# EAGLE design Adafruit MatrixPortal M4 (EAGLE 9.6.2)
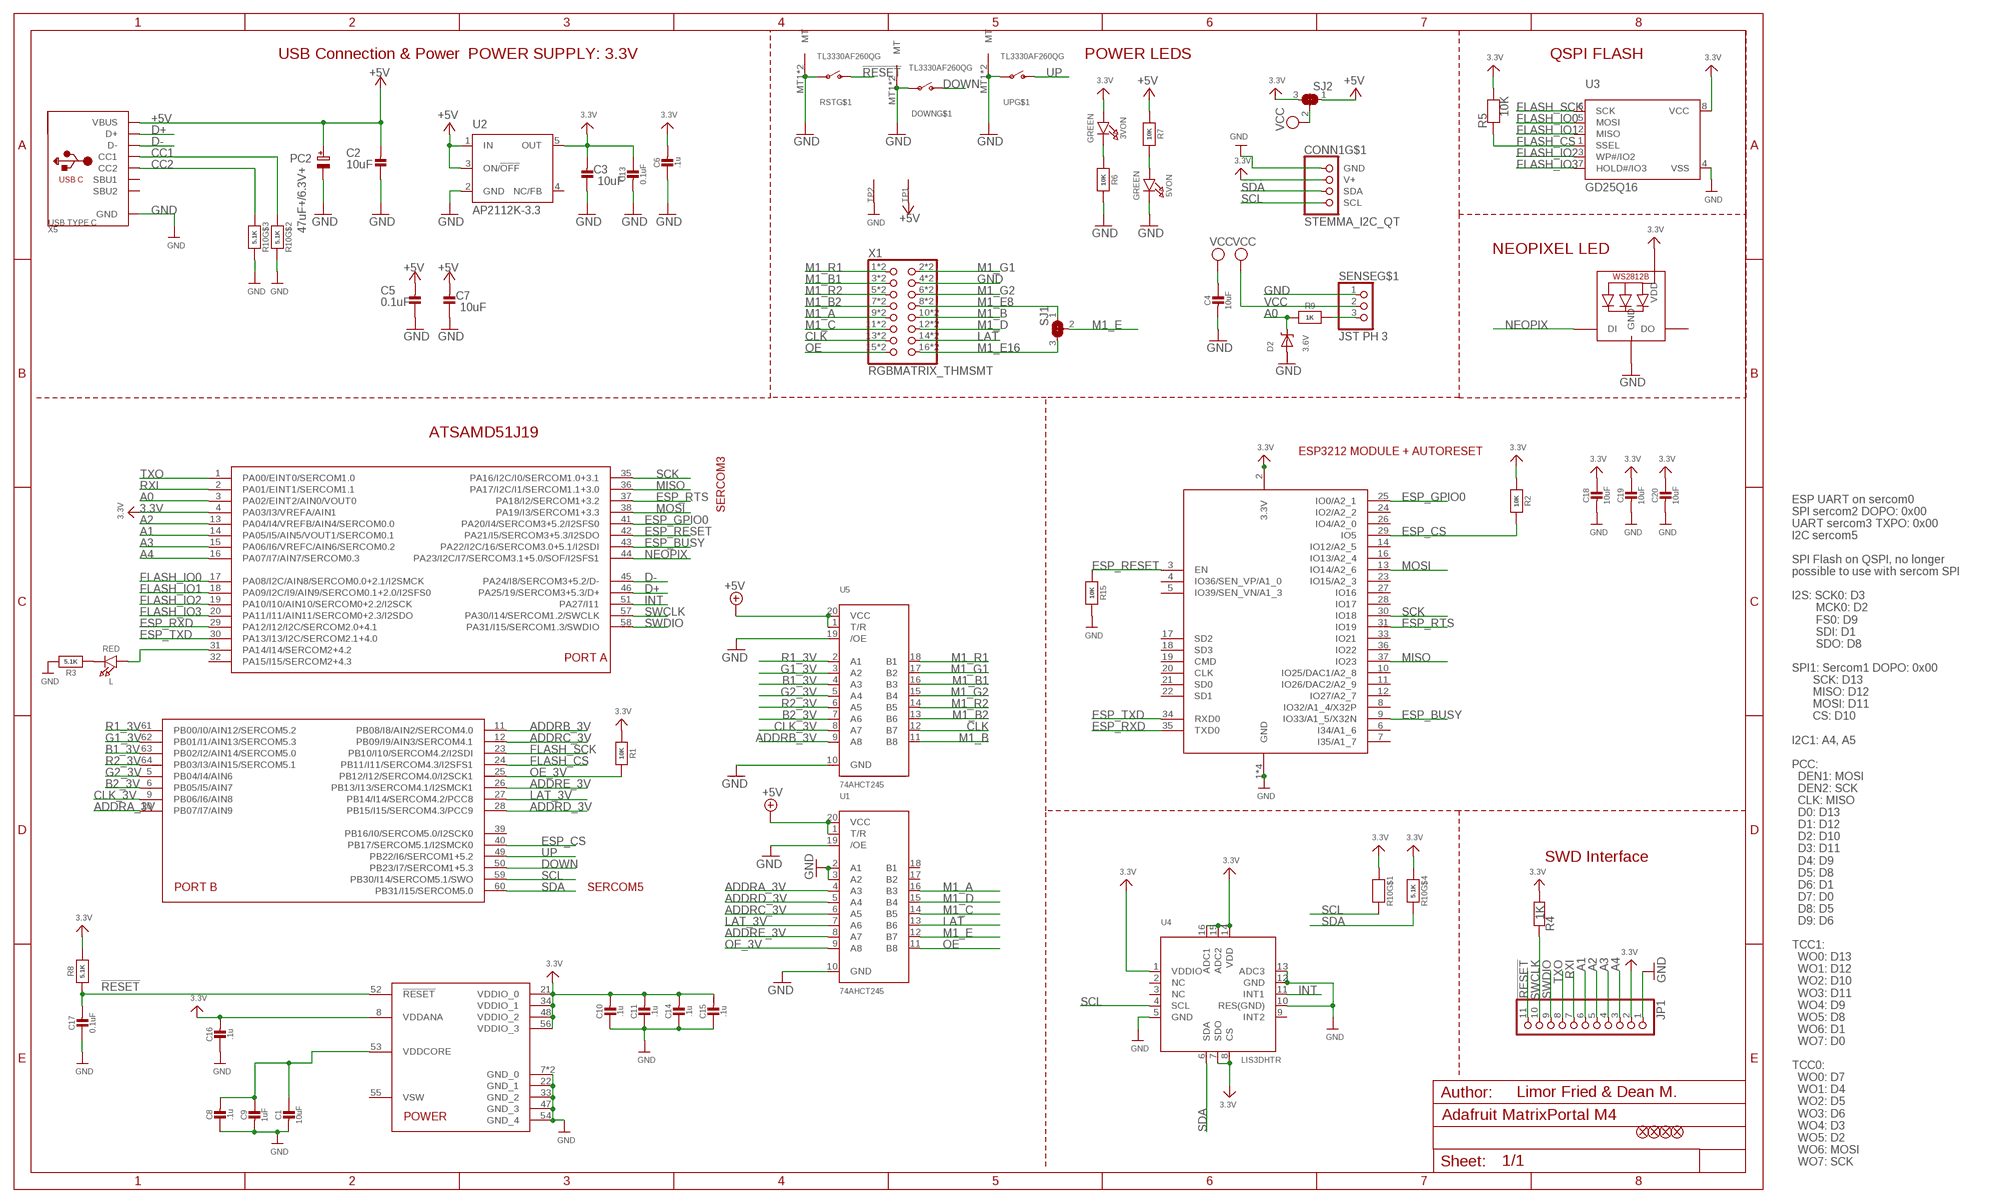
[diagram p0: schematic, sheet 1]

## Parts
3VON  GREEN  LED0805_NOOUTLINE  [CHIPLED_0805_NOOUTLINE]
5VON  GREEN  LED0805_NOOUTLINE  [CHIPLED_0805_NOOUTLINE]
C1  10uF  CAP_CERAMIC0805-NOOUTLINE  [0805-NO]
C2  10uF  CAP_CERAMIC0805-NOOUTLINE  [0805-NO]
C3  10uF  CAP_CERAMIC0805-NOOUTLINE  [0805-NO]
C4  10uF  CAP_CERAMIC0805-NOOUTLINE  [0805-NO]
C5  0.1uF  CAP_CERAMIC0603_NO  [0603-NO]
C6  .1u  CAP_CERAMIC0603_NO  [0603-NO]
C7  10uF  CAP_CERAMIC0805-NOOUTLINE  [0805-NO]
C8  .1u  CAP_CERAMIC0603_NO  [0603-NO]
C9  1uF  CAP_CERAMIC0603_NO  [0603-NO]
C10  .1u  CAP_CERAMIC0603_NO  [0603-NO]
C11  .1u  CAP_CERAMIC0603_NO  [0603-NO]
C13  0.1uF  CAP_CERAMIC0603_NO  [0603-NO]
C14  .1u  CAP_CERAMIC0603_NO  [0603-NO]
C15  .1u  CAP_CERAMIC0603_NO  [0603-NO]
C16  .1u  CAP_CERAMIC0603_NO  [0603-NO]
C17  0.1uF  CAP_CERAMIC0603_NO  [0603-NO]
C18  10uF  CAP_CERAMIC0805-NOOUTLINE  [0805-NO]
C19  10uF  CAP_CERAMIC0805-NOOUTLINE  [0805-NO]
C20  10uF  CAP_CERAMIC0805-NOOUTLINE  [0805-NO]
CONN1  STEMMA_I2C_QT  [JST_SH4]
D2  3.6V  DIODE-ZENERSOD323  [SOD-323]
DOWN  TL3330AF260QG  SWITCH_SPST_TACT_RA  [SPST_TACTILE_RA]
FID1  FIDUCIAL_1MM  [FIDUCIAL_1MM]
FID2  FIDUCIAL_1MM  [FIDUCIAL_1MM]
FID3  FIDUCIAL_1MM  [FIDUCIAL_1MM]
FID4  FIDUCIAL_1MM  [FIDUCIAL_1MM]
JP1  HEADER-1X11  [1X11_ROUND]
L  RED  LED0603_NOOUTLINE  [CHIPLED_0603_NOOUTLINE]
LED1  WS2812B3535  [LED3535]
PC2  47uF+/6.3V+  CAP_ELECTROLYTICPANASONIC_D  [PANASONIC_D]
R1  10K  RESISTOR_0603_NOOUT  [0603-NO]
R2  10K  RESISTOR_0603_NOOUT  [0603-NO]
R3  5.1K  RESISTOR_0603_NOOUT  [0603-NO]
R4  1K  RESISTOR_0603_NOOUT  [0603-NO]
R5  10K  RESISTOR_0603_NOOUT  [0603-NO]
R6  10K  RESISTOR_0603_NOOUT  [0603-NO]
R7  10K  RESISTOR_0603_NOOUT  [0603-NO]
R8  5.1K  RESISTOR_0603_NOOUT  [0603-NO]
R9  1K  RESISTOR_0603_NOOUT  [0603-NO]
R10  5.1K  RESISTOR_4PACK  [RESPACK_4X0603]
R15  10K  RESISTOR_0603_NOOUT  [0603-NO]
RST  TL3330AF260QG  SWITCH_SPST_TACT_RA  [SPST_TACTILE_RA]
SENSE  JST PH 3  CON_JST_PH_3PIN  [JSTPH3]
SJ1  SOLDERJUMPER_2WAY  [SOLDERJUMPER_2WAY_OPEN_NOPASTE]
SJ2  SOLDERJUMPER_2WAY  [SOLDERJUMPER_2WAY_OPEN_NOPASTE]
TP1  SEWTAP_SMTNUTM3  [SMT_NUT_3MM]
TP2  SEWTAP_SMTNUTM3  [SMT_NUT_3MM]
U1  74AHCT245  74LCX245  [TSSOP20]
U2  AP2112K-3.3  LP2985-XXDBVR33  [SOT23-DBV]
U3  GD25Q16  SPIFLASH_8PIN208MIL  [SOIC8_208MIL]
U4  LIS3DHTR  ACCEL_LIS3DHTR  [LGA16_3X3MM]
U5  74AHCT245  74LCX245  [TSSOP20]
U$1  ATSAMD51J19  ATSAMD51J  [PQFN64-1]
UP  TL3330AF260QG  SWITCH_SPST_TACT_RA  [SPST_TACTILE_RA]
X1  RGBMATRIX_THMSMT  [2X08_SMTTHM_RGBMATRIX]
X5  USB TYPE C  USB_C  [USB_C_CUSB31-CFM2AX-01-X]
X6  ESP32_WROOM32  [WROOM32]

## Nets
3.3V: 3VON.A C3.2 C6.2 C10.2 C11.2 C13.1 C14.2 C15.2 C16.2 C18.1 C19.1 C20.1 CONN1.2(V+) JP1.2 LED1.2(VDD) R1.1 R2.1 R4.2 R5.2 R8.2 R10.1 R10.4 SJ2.3 U2.5(OUT) U3.8(VCC) U4.1(VDDIO) U4.7(SDO) U4.8(CS) U4.14(VDD) U4.15(ADC2) U4.16(ADC1) U$1.4(PA03/I3/VREFA/AIN1) U$1.8(VDDANA) U$1.21(VDDIO_0) U$1.34(VDDIO_1) U$1.48(VDDIO_2) U$1.56(VDDIO_3) X6.2(3.3V)
!RESET: C17.2 JP1.11 R8.1 RST.2(S) U$1.52(!RESET)
+5V [usbvcc]: C2.2 C5.2 C7.2 PC2.+ R7.1 SJ2.1 TP1.P$1(SEW) U1.1(T/R) U1.20(VCC) U2.1(IN) U2.3(ON/!OFF) U5.1(T/R) U5.20(VCC) X5.A4B9(VBUS) X5.B4A9(VBUS)
A0: D2.C R9.2 U$1.3(PA02/EINT2/AIN0/VOUT0)
A0_JST: R9.1 SENSE.3
A1: JP1.6 U$1.14(PA05/I5/AIN5/VOUT1/SERCOM0.1)
A2: JP1.5 U$1.13(PA04/I4/VREFB/AIN4/SERCOM0.0)
A3: JP1.4 U$1.15(PA06/I6/VREFC/AIN6/SERCOM0.2)
A4: JP1.3 U$1.16(PA07/I7/AIN7/SERCOM0.3)
ADDRA_3V: U1.4(A3) U$1.10(PB07/I7/AIN9)
ADDRB_3V: U5.9(A8) U$1.11(PB08/I8/AIN2/SERCOM4.0)
ADDRC_3V: U1.6(A5) U$1.12(PB09/I9/AIN3/SERCOM4.1)
ADDRD_3V: U1.5(A4) U$1.28(PB15/I15/SERCOM4.3/PCC9)
ADDRE_3V: U1.8(A7) U$1.26(PB13/I13/SERCOM4.1/I2SMCK1)
B1_3V: U5.4(A3) U$1.63(PB02/I2/AIN14/SERCOM5.0)
B2_3V: U5.7(A6) U$1.6(PB05/I5/AIN7)
CC1: R10.2 X5.A5(CC1)
CC2: R10.3 X5.B5(CC2)
CLK: U5.12(B7) X1.13 X1.13S
CLK_3V: U5.8(A7) U$1.9(PB06/I6/AIN8)
D+: U$1.46(PA25/19/SERCOM3+5.3/D+) X5.A6(D+) X5.B6(D+)
D-: U$1.45(PA24/I8/SERCOM3+5.2/D-) X5.A7(D-) X5.B7(D-)
DOWN: DOWN.2(S) U$1.50(PB23/I7/SERCOM1+5.3)
ESP_BUSY: U$1.43(PA22/I2C/16/SERCOM3.0+5.1/I2SDI) X6.9(IO33/A1_5/X32N)
ESP_CS: R2.2 U$1.40(PB17/SERCOM5.1/I2SMCK0) X6.29(IO5)
ESP_GPIO0: U$1.41(PA20/I4/SERCOM3+5.2/I2SFS0) X6.25(IO0/A2_1)
ESP_RESET: R15.1 U$1.42(PA21/I5/SERCOM3+5.3/I2SDO) X6.3(EN)
ESP_RTS: U$1.37(PA18/I2/SERCOM1+3.2) X6.31(IO19)
ESP_RXD: U$1.29(PA12/I12/I2C/SERCOM2.0+4.1) X6.35(TXD0)
ESP_TXD: U$1.30(PA13/I13/I2C/SERCOM2.1+4.0) X6.34(RXD0)
FLASH_CS: R5.1 U3.1(SSEL) U$1.24(PB11/I11/SERCOM4.3/I2SFS1)
FLASH_IO0: U3.5(MOSI) U$1.17(PA08/I2C/AIN8/SERCOM0.0+2.1/I2SMCK)
FLASH_IO1: U3.2(MISO) U$1.18(PA09/I2C/I9/AIN9/SERCOM0.1+2.0/I2SFS0)
FLASH_IO2: U3.3(WP#/IO2) U$1.19(PA10/I10/AIN10/SERCOM0+2.2/I2SCK)
FLASH_IO3: U3.7(HOLD#/IO3) U$1.20(PA11/I11/AIN11/SERCOM0+2.3/I2SDO)
FLASH_SCK: U3.6(SCK) U$1.23(PB10/I10/SERCOM4.2/I2SDI)
G1_3V: U5.3(A2) U$1.62(PB01/I1/AIN13/SERCOM5.3)
G2_3V: U5.5(A4) U$1.5(PB04/I4/AIN6)
GND [lowpower]: 5VON.C C1.2 C2.1 C3.1 C4.2 C5.1 C6.1 C7.1 C8.1 C9.2 C10.1 C11.1 C13.2 C14.1 C15.1 C16.1 C17.1 C18.2 C19.2 C20.2 CONN1.1(GND) D2.A DOWN.1(P) DOWN.MT1(MT) DOWN.MT2(MT) JP1.1 LED1.4(GND) PC2.- R3.2 R6.2 R10.6 R10.7 R15.2 RST.1(P) RST.MT1(MT) RST.MT2(MT) SENSE.1 TP2.P$1(SEW) U1.2(A1) U1.3(A2) U1.10(GND) U1.19(/OE) U2.2(GND) U3.4(VSS) U4.5(GND) U4.10(RES(GND)) U4.12(GND) U4.13(ADC3) U5.10(GND) U5.19(/OE) U$1.7(GND_0) U$1.22(GND_1) U$1.33(GND_2) U$1.47(GND_3) U$1.54(GND_4) U$1.EXP(GND_0) UP.1(P) UP.MT1(MT) UP.MT2(MT) X1.4 X1.4S X5.A1B12(GND) X5.B1A12(GND) X6.1(GND) X6.15(GND) X6.38(GND) X6.P$1(GND)
INT: U4.11(INT1) U$1.51(PA27/I11)
LAT: U1.13(B6) X1.14 X1.14S
LAT_3V: U1.7(A6) U$1.27(PB14/I14/SERCOM4.2/PCC8)
M1_A: U1.16(B3) X1.9 X1.9S
M1_B: U5.11(B8) X1.10 X1.10S
M1_B1: U5.16(B3) X1.3 X1.3S
M1_B2: U5.13(B6) X1.7 X1.7S
M1_C: U1.14(B5) X1.11 X1.11S
M1_D: U1.15(B4) X1.12 X1.12S
M1_E: SJ1.2 U1.12(B7)
M1_E8: SJ1.1 X1.8 X1.8S
M1_E16: SJ1.3 X1.16 X1.16S
M1_G1: U5.17(B2) X1.2 X1.2S
M1_G2: U5.15(B4) X1.6 X1.6S
M1_R1: U5.18(B1) X1.1 X1.1S
M1_R2: U5.14(B5) X1.5 X1.5S
MISO: U$1.36(PA17/I2C/I1/SERCOM1.1+3.0) X6.37(IO23)
MOSI: U$1.38(PA19/I3/SERCOM1+3.3) X6.13(IO14/A2_6)
N$1: 5VON.A R7.2
N$2: 3VON.C R6.1
N$4: L.A U$1.31(PA14/I14/SERCOM2+4.2)
N$5: L.C R3.1
NEOPIX: LED1.1(DI) U$1.44(PA23/I2C/I7/SERCOM3.1+5.0/SOF/I2SFS1)
OE: U1.11(B8) X1.15 X1.15S
OE_3V: R1.2 U1.9(A8) U$1.25(PB12/I12/SERCOM4.0/I2SCK1)
R1_3V: U5.2(A1) U$1.61(PB00/I0/AIN12/SERCOM5.2)
R2_3V: U5.6(A5) U$1.64(PB03/I3/AIN15/SERCOM5.1)
RXI: JP1.7 U$1.2(PA01/EINT1/SERCOM1.1)
SCK: U$1.35(PA16/I2C/I0/SERCOM1.0+3.1) X6.30(IO18)
SCL: CONN1.4(SCL) R10.8 U4.4(SCL) U$1.59(PB30/I14/SERCOM5.1/SWO)
SDA: CONN1.3(SDA) R10.5 U4.6(SDA) U$1.60(PB31/I15/SERCOM5.0)
SWCLK: JP1.10 R4.1 U$1.57(PA30/I14/SERCOM1.2/SWCLK)
SWDIO: JP1.9 U$1.58(PA31/I15/SERCOM1.3/SWDIO)
TXO: JP1.8 U$1.1(PA00/EINT0/SERCOM1.0)
UP: U$1.49(PB22/I6/SERCOM1+5.2) UP.2(S)
VCC [power]: C4.1 SENSE.2 SJ2.2
VDDCORE: C1.1 C8.2 C9.1 U$1.53(VDDCORE)
Unconnected: CONN1.MT1(MT) CONN1.MT2(MT) LED1.3(DO) SENSE.NC1(MT) SENSE.NC2(MT) U1.17(B2) U1.18(B1) U2.4(NC/FB) U4.2(NC) U4.3(NC) U4.9(INT2) U$1.32(PA15/I15/SERCOM2+4.3) U$1.39(PB16/I0/SERCOM5.0/I2SCK0) U$1.55(VSW) X5.A8(SBU1) X5.B8(SBU2) X6.4(IO36/SEN_VP/A1_0) X6.5(IO39/SEN_VN/A1_3) X6.6(I34/A1_6) X6.7(I35/A1_7) X6.8(IO32/A1_4/X32P) X6.10(IO25/DAC1/A2_8) X6.11(IO26/DAC2/A2_9) X6.12(IO27/A2_7) X6.14(IO12/A2_5) X6.16(IO13/A2_4) X6.17(SD2) X6.18(SD3) X6.19(CMD) X6.20(CLK) X6.21(SD0) X6.22(SD1) X6.23(IO15/A2_3) X6.24(IO2/A2_2) X6.26(IO4/A2_0) X6.27(IO16) X6.28(IO17) X6.33(IO21) X6.36(IO22)

## Notes on the sheet
- USB Connection & Power | POWER SUPPLY: 3.3V | POWER LEDS | QSPI FLASH
- NEOPIXEL LED
- ATSAMD51J19
- ESP3212 MODULE + AUTORESET
- SERCOM3
- SWD Interface
- SERCOM5
- Limor Fried & Dean M.
- ESP UART on sercom0
  SPI sercom2 DOPO: 0x00
  UART sercom3 TXPO: 0x00
  I2C sercom5
  
  SPI Flash on QSPI, no longer
  possible to use with sercom SPI
  
  I2S: SCK0: D3
          MCK0: D2
          FS0: D9
          SDI: D1
          SDO: D8
  
  SPI1: Sercom1 DOPO: 0x00
         SCK: D13
         MISO: D12
         MOSI: D11
         CS: D10
  
  I2C1: A4, A5
  
  PCC:
    DEN1: MOSI
    DEN2: SCK
    CLK: MISO
    D0: D13
    D1: D12
    D2: D10
    D3: D11
    D4: D9
    D5: D8
    D6: D1
    D7: D0
    D8: D5
    D9: D6
  
  TCC1:
    WO0: D13
    WO1: D12
    WO2: D10
    WO3: D11
    WO4: D9
    WO5: D8
    WO6: D1
    WO7: D0
  
  TCC0:
    WO0: D7
    WO1: D4
    WO2: D5
    WO3: D6
    WO4: D3
    WO5: D2
    WO6: MOSI
    WO7: SCK

## Library data of the parts
3VON 5VON L = microbuilder:LED: LED 0603 - 0603 Surface Mount Package 2mA: Green LED - Low Power (3.9mcd, 2ma, 1.7Vf) - Digikey: 475-2709-2-ND Orange LED - Low Power (9.8mcd, 2ma, 1.8Vf) - Digikey: 475-1194-2-ND Red LED - Low Power (5mcd, 2ma, 1.8Vf) - Digikey: 475-1195-2-ND Yellow LED - Low Power (7mcd, 2ma, 1.8Vf) - Digikey: 475-1196-2-ND 5mA: Blue LED - Low Power (17mcd, 5ma, 2.9Vf) - Digikey: LNJ937W8CRACT-ND 0805 - 0805 Surface Mount Package 2mA: Red LED (8.8mcd, 2mA, 1.8Vf, Clear) - Low Power [Digikey: 475-2510-1-ND] Green LED (5mcd, 2mA, 1.8Vf, Clear) - Low Power [Digikey: 475-2730-1-ND] Yellow LED (11.3mcd, 2mA, 1.8Vf, Clear) - Low Power [Digikey: 475-2555-1-ND] 20mA: Red LED (104mcd, 20mA, Diffused) - LS R976 [Digikey: 475-1278-6-ND] Red LED (12mcd, 20mA, 2.0Vf, Clear) - APT2012EC [Digikey: 754-1128-1-ND] Green LED (15mcd, 20mA, 2.2Vf, Clear) - APT2012GC [Digikey: 754-1131-1-ND] Orange LED (160mcd, 20mA, 2.1Vf, Clear) - APT2012SECK [Digikey: 754-1130-1-ND] 1206 - 1206 Surface Mount Package Green LED (26mcd, 20mA, Diffused) - LG N971 [Digikey: 475-1407-6-ND] Red LED (15mcd, 20mA, Diffused) - LH N974 [Digikey: 475-1416-6-ND] Cree - Cree High-Power Surface Mount LEDs XPEBWT-L1-0000-00D50 - White 111lm 350mA 2.9Vf 6200K 110° XTEAWT-00-0000-00000LEE3 - White 114lm 350mA 2.85Vf 5000K 115° Everlight - Everlight 45-21 Series Surface Mount LEDs 45-21/QK2C-B2832AC2CB2/2T - Warm White 2000mcd 20mA 3.25Vf 3050K 120° 45-21/LK2C-B38452C4CB2/2T - Nuetral White 2000mcd 20mA 3.25Vf 4150K 120° 45-21/LK2C-B50634C6CB2/2T - Cold White 2200mcd 20mA 3.25Vf 5650K 120° PLCC2 Reverse Mount LS T77K-J1L2-1-0-2-R18-Z - Red 11.25mcd 2mA 1.8Vf 630nm 120° LO T77K-L1M2-24-Z - Orange 19.6mcd 2mA 1.8Vf 606nm 120° LY T77K-K2M1-26-Z - Yellow 15.7mcd 2mA 1.8Vf 587nm 120°
C1-C11 C13-C20 = microbuilder:CAP_CERAMIC: Ceramic Capacitors For new designs, use the packages preceded by an '_' character since they are more reliable: The following footprints should be used on most boards: _0402 - Standard footprint for regular board layouts _0603 - Standard footprint for regular board layouts _0805 - Standard footprint for regular board layouts _1206 - Standard footprint for regular board layouts For extremely tight-pitch boards where space is at a premium, the following 'micro-pitch' footprints can be used (smaller pads, no silkscreen outline, etc.): _0402MP - Micro-pitch footprint for very dense/compact boards _0603MP - Micro-pitch footprint for very dense/compact boards _0805MP - Micro-pitch footprint for very dense/compact boards _1206MP - Micro-pitch footprint for very dense/compact boards
CONN1 = microbuilder:STEMMA_I2C
D2 = microbuilder:DIODE-ZENER: Zener Diode SMA: 30V 1W Zener Diode, 1.2Vf - Digikey: SMAZ30-FDICT-ND
DOWN RST UP = microbuilder:SWITCH_SPST: Switch - SPST 4UCon 19192 (6.7x2.6mm SMT)
FID1-FID4 = microbuilder:FIDUCIAL: Fiducial Alignment Points Various fiducial points for machine vision alignment.; BOM: EXCLUDE
JP1 = microbuilder:HEADER-1X11
LED1 = microbuilder:WS2812B
PC2 = microbuilder:CAP_ELECTROLYTIC: Electrolytic Capacitors SMT PANASONIC_C - Size C Panasonic Electrolytic Aluminum Capacitor 47µF 16V 20% Electrolytic Capacitor [Digikey: PCE3890TR-ND] PANASONIC_D - Size D Panasonic Electrolytic Aluminum Capacitor 100µF 25V 20% Electrolytic Capacitor [Digikey: PCE3898TR-ND] PTH 3.5 mm grid, 8 mm diameter ... 3.5 mm grid, 10 mm diameter ...
R1-R9 R15 = microbuilder:RESISTOR: Resistors For new designs, use the packages preceded by an '_' character since they are more reliable: The following footprints should be used on most boards: _0402 - Standard footprint for regular board layouts _0603 - Standard footprint for regular board layouts _0805 - Standard footprint for regular board layouts _1206 - Standard footprint for regular board layouts For extremely tight-pitch boards where space is at a premium, the following 'micro-pitch' footprints can be used (smaller pads, no silkscreen outline, etc.): _0402MP - Micro-pitch footprint for very dense/compact boards _0603MP - Micro-pitch footprint for very dense/compact boards _0805MP - Micro-pitch footprint for very dense/compact boards _1206MP - Micro-pitch footprint for very dense/compact boards
R10 = microbuilder:RESISTOR_4PACK: Resistor Packs (4 resistors) 4 x 0603 10K 1/16W - Digikey: YC164J-10KCT-ND
SENSE = microbuilder:CON_JST_PH_3PIN
SJ1 SJ2 = microbuilder:SOLDERJUMPER_2WAY: 2-Way Solder Jumper
TP1 TP2 = microbuilder:SEWTAP
U1 U5 = microbuilder:74LCX245: 74LCX245MTC - 5.0V Tolerant Bi-Directional Buffer Can be used to interface 5.0V logic to 2.5 or 3.3V devices Digikey: 74LCX245MTCXTR-ND Mouser: 512-74LCX245MTCX
U2 = SmartPrj:LP2985-XXDBVR: ULTRALOW-POWER 50-mA LOW-DROPOUT LINEAR REGULATORS 50-mA Low-Dropout Regulator Source: http://focus.ti.com/lit/ds/symlink/tps77001.pdf
U3 = microbuilder:SPIFLASH_8PIN: SOIC8 SPI Flash Be careful with the size since SOIC8 flash comes in several 'widths' SOIC8 150 mil M25P16 - 16Mbit (2Mbit x 8) Serial Flash (75MHz SPI Bus), Supply: 2.7-3.6V Digikey: SOIC8 - M25P16-VMN6P-ND SOIC8 208 mil W25Q16BVSSIG - 16Mbit (2Mbit x 8) Serial Flash (104MHz SPI Bus), Supply: 2.7-3.6V Digikey: SOIC8 - W25Q16BVSSIG-ND
U4 = adafruit_sensor:ACCEL_LIS3DHTR: LIS3DHTR 3-Axis Accelerometer with I2C/SPI Interface VDD: 1.71-3.6V VDDIO: 1.71-VDD+0.1V Scale: +/-2g, 4g, 8g, 16g with 16--bit data output Temp:: -40°C - 85°C Mouser: 511-LIS3DHTR Digikey: 497-10613-1-ND
U$1 = adafruit_micro:ATSAMD51J: ATSAMD51J cortex m4 microcontroller
X1 = microbuilder:RGBMATRIX_THMSMT
X5 = microbuilder:USB_C: USB Type-C USB 2.0 Connector
X6 = microbuilder:ESP32_WROOM32

## Net classes
1 power: width 0.305 mm
2 lowpower: width 0.305 mm, drill 0.483 mm

## Board
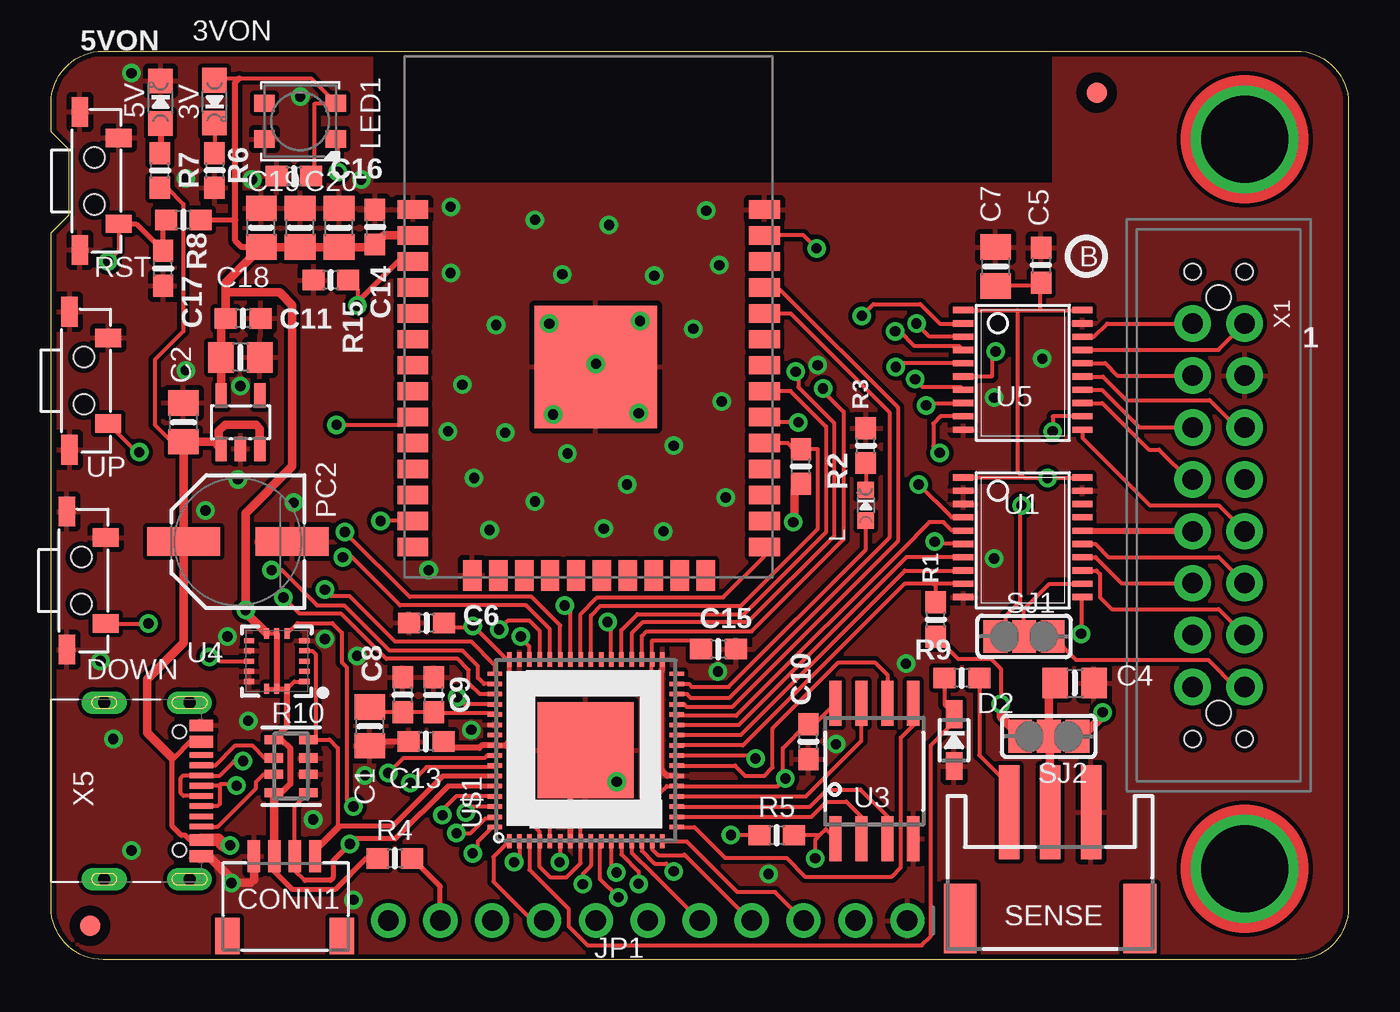
[diagram p1: board, top side]
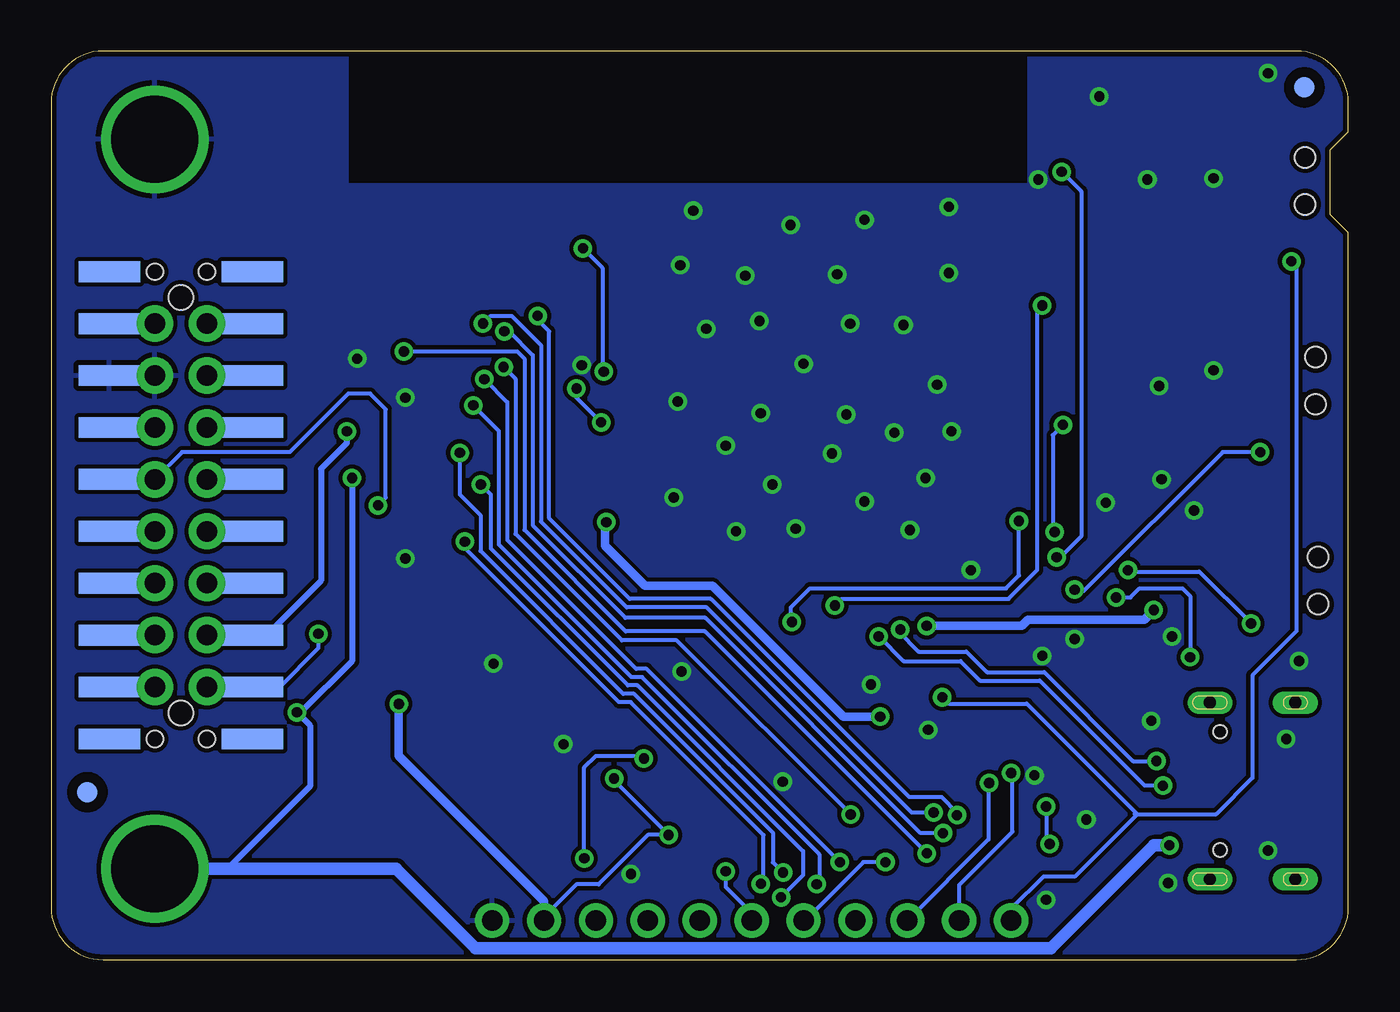
[diagram p2: board, bottom side, seen from below]

Size 63.5 x 44.45 mm. Coordinates in mm from the lower left corner, seen from the top.
Outline: 63.5,41.91 63.5,2.54 arc-90 60.96,0 2.54,0 arc-90 0,2.54 0,35.56 0.89,36.45 0.89,39.62 0,40.51 0,41.91 arc-90 2.54,44.45 60.96,44.45 arc-90 63.5,41.91
Copper layers (1*16): Top 0.035mm / dielectric 1.5mm / Bottom 0.035mm
Design rules "adafruit *": minimum track width 8mil, minimum drill 15.5mil, track to track 8mil, track to pad 8mil, pad to pad 8mil, via to via 8mil, smd to smd 8mil, copper to edge 10mil, drill to drill 8mil, minimum pad ring 10mil, minimum via ring 8mil, stop-mask expansion 2mil, vias tented up to drill 20mil, thermal gap 10mil

### Footprints (pad centres in the part's own frame; a part is rotated, then mirrored left to right if it is on the bottom)
CHIPLED_0805_NOOUTLINE = smd 1.2 x 1.2: A 0,-1.05; C 0,1.05
0805-NO = smd 1.24 x 1.5: 1 -0.95,0; 2 0.95,0
0603-NO = smd 1.075 x 1: 1 -0.85,0; 2 0.85,0
JST_SH4 = smd 0.6 x 1.55: 1 -1.5,2.514; 2 -0.5,2.514; 3 0.5,2.514; 4 1.5,2.514 | smd 1.2 x 1.8: MT1 -2.8,-1.386; MT2 2.8,-1.386
SOD-323 = smd 1.35 x 0.8: A 1.27,0; C -1.27,0
SPST_TACTILE_RA = smd 0.9 x 1.27: 1 -2.1,0.9; 2 2.1,0.9 | smd 1.45 x 0.8: MT1 -3.375,-1; MT2 3.375,-1 | hole 1: -1.15,-0.3; 1.15,-0.3
FIDUCIAL_1MM = smd 1 x 1: 1 0,0
1X11_ROUND = drill 1 pad 1.676: 1 -12.7,0; 2 -10.16,0; 3 -7.62,0; 4 -5.08,0; 5 -2.54,0; 6 0,0; 7 2.54,0; 8 5.08,0; 9 7.62,0; 10 10.16,0; 11 12.7,0
CHIPLED_0603_NOOUTLINE = smd 0.8 x 0.8: A 0,-0.75; C 0,0.75
LED3535 = smd 1 x 0.85: 1 -1.75,0.875; 2 -1.75,-0.875; 3 1.75,-0.875; 4 1.75,0.875
PANASONIC_D = smd 3.556 x 1.4: + 2.654,0; - -2.654,0
RESPACK_4X0603 = smd 0.45 x 0.9: 1 -1.3,-0.85; 2 -0.4,-0.85; 3 0.4,-0.85; 4 1.3,-0.85; 5 1.3,0.85; 6 0.4,0.85; 7 -0.4,0.85; 8 -1.3,0.85
JSTPH3 = smd 1 x 4.6: 1 -2,-2.7; 2 0,-2.7; 3 2,-2.7 | smd 1.6 x 3.4: NC1 -4.4,2.5; NC2 4.4,2.5
SOLDERJUMPER_2WAY_OPEN_NOPASTE = smd 1.168 x 1.6: 1 -1.397,0; 2 0,0; 3 1.397,0
SMT_NUT_3MM = drill 4.25 pad 4.572: P$1 0,0
TSSOP20 = smd 0.305 x 0.991: 1 -3.075,-2.918; 2 -2.425,-2.918; 3 -1.775,-2.918; 4 -1.125,-2.918; 5 -0.475,-2.918; 6 0.175,-2.918; 7 0.825,-2.918; 8 1.475,-2.918; 9 2.125,-2.918; 10 2.775,-2.918; 11 2.775,2.918; 12 2.125,2.918; 13 1.475,2.918; 14 0.825,2.918; 15 0.175,2.918; 16 -0.475,2.918; 17 -1.125,2.918; 18 -1.775,2.918; 19 -2.425,2.918; 20 -3.075,2.918
SOT23-DBV = smd 0.55 x 1.2: 1 -0.95,-1.3; 2 0,-1.3; 3 0.95,-1.3; 4 0.95,1.3; 5 -0.95,1.3
SOIC8_208MIL = smd 0.6 x 2.2: 1 -1.905,-3.315; 2 -0.635,-3.315; 3 0.635,-3.315; 4 1.905,-3.315; 5 1.905,3.315; 6 0.635,3.315; 7 -0.635,3.315; 8 -1.905,3.315
LGA16_3X3MM = smd 0.5 x 0.25: 1 -1.35,1; 2 -1.35,0.5; 3 -1.35,0; 4 -1.35,-0.5; 5 -1.35,-1; 9 1.35,-1; 10 1.35,-0.5; 11 1.35,0; 12 1.35,0.5; 13 1.35,1 | smd 0.25 x 0.5: 6 -0.5,-1.35; 7 0,-1.35; 8 0.5,-1.35; 14 0.5,1.35; 15 0,1.35; 16 -0.5,1.35
PQFN64-1 = smd 0.7 x 0.22: 1 -4.45,3.75; 2 -4.45,3.25; 3 -4.45,2.75; 4 -4.45,2.25; 5 -4.45,1.75; 6 -4.45,1.25; 7 -4.45,0.75; 8 -4.45,0.25; 9 -4.45,-0.25; 10 -4.45,-0.75; 11 -4.45,-1.25; 12 -4.45,-1.75; 13 -4.45,-2.25; 14 -4.45,-2.75; 15 -4.45,-3.25; 16 -4.45,-3.75; 33 4.45,-3.75; 34 4.45,-3.25; 35 4.45,-2.75; 36 4.45,-2.25; 37 4.45,-1.75; 38 4.45,-1.25; 39 4.45,-0.75; 40 4.45,-0.25; 41 4.45,0.25; 42 4.45,0.75; 43 4.45,1.25; 44 4.45,1.75; 45 4.45,2.25; 46 4.45,2.75; 47 4.45,3.25; 48 4.45,3.75 | smd 0.22 x 0.7: 17 -3.75,-4.45; 18 -3.25,-4.45; 19 -2.75,-4.45; 20 -2.25,-4.45; 21 -1.75,-4.45; 22 -1.25,-4.45; 23 -0.75,-4.45; 24 -0.25,-4.45; 25 0.25,-4.45; 26 0.75,-4.45; 27 1.25,-4.45; 28 1.75,-4.45; 29 2.25,-4.45; 30 2.75,-4.45; 31 3.25,-4.45; 32 3.75,-4.45; 49 3.75,4.45; 50 3.25,4.45; 51 2.75,4.45; 52 2.25,4.45; 53 1.75,4.45; 54 1.25,4.45; 55 0.75,4.45; 56 0.25,4.45; 57 -0.25,4.45; 58 -0.75,4.45; 59 -1.25,4.45; 60 -1.75,4.45; 61 -2.25,4.45; 62 -2.75,4.45; 63 -3.25,4.45; 64 -3.75,4.45 | smd 4.7 x 4.7: EXP 0,0
2X08_SMTTHM_RGBMATRIX = drill 1 pad 1.778: 1 -8.89,-1.27; 2 -8.89,1.27; 3 -6.35,-1.27; 4 -6.35,1.27; 5 -3.81,-1.27; 6 -3.81,1.27; 7 -1.27,-1.27; 8 -1.27,1.27; 9 1.27,-1.27; 10 1.27,1.27; 11 3.81,-1.27; 12 3.81,1.27; 13 6.35,-1.27; 14 6.35,1.27; 15 8.89,-1.27; 16 8.89,1.27 | smd 1.02 x 3 bottom: 1S -8.89,-3.5; 2S -8.89,3.5; 3S -6.35,-3.5; 4S -6.35,3.5; 5S -3.81,-3.5; 6S -3.81,3.5; 7S -1.27,-3.5; 8S -1.27,3.5; 9S 1.27,-3.5; 10S 1.27,3.5; 11S 3.81,-3.5; 12S 3.81,3.5; 13S 6.35,-3.5; 14S 6.35,3.5; 15S 8.89,-3.5; 16S 8.89,3.5; NC0 -11.43,3.5; NC1 -11.43,-3.5; NC2 11.43,3.5; NC3 11.43,-3.5 | hole 1.2: -10.16,0; 10.16,0 | hole 0.8: -11.43,1.27; -11.43,-1.27; 11.43,1.27; 11.43,-1.27
USB_C_CUSB31-CFM2AX-01-X = smd 0.575 x 1.15: A1B12 -3.2,3.545; A4B9 -2.4,3.545; B1A12 3.2,3.545; B4A9 2.4,3.545 | smd 0.275 x 1.15: A5 -1.25,3.545; A6 -0.25,3.545; A7 0.25,3.545; A8 1.25,3.545; B5 1.75,3.545; B6 0.75,3.545; B7 -0.75,3.545; B8 -1.75,3.545 | drill 0.6 pad 1 long: M1 -4.32,2.97; M2 4.32,2.97; M3 -4.32,-1.21; M4 4.32,-1.21 | hole 0.65: 2.89,2.47; -2.89,2.47
WROOM32 = smd 1.5 x 0.9: 1 -8.6,5; 2 -8.6,3.73; 3 -8.6,2.46; 4 -8.6,1.19; 5 -8.6,-0.08; 6 -8.6,-1.35; 7 -8.6,-2.62; 8 -8.6,-3.89; 9 -8.6,-5.16; 10 -8.6,-6.43; 11 -8.6,-7.7; 12 -8.6,-8.97; 13 -8.6,-10.24; 14 -8.6,-11.51; 25 8.6,-11.51; 26 8.6,-10.24; 27 8.6,-8.97; 28 8.6,-7.7; 29 8.6,-6.43; 30 8.6,-5.16; 31 8.6,-3.89; 32 8.6,-2.62; 33 8.6,-1.35; 34 8.6,-0.08; 35 8.6,1.19; 36 8.6,2.46; 37 8.6,3.73; 38 8.6,5 | smd 0.9 x 1.5: 15 -5.7,-12.9; 16 -4.43,-12.9; 17 -3.16,-12.9; 18 -1.89,-12.9; 19 -0.62,-12.9; 20 0.65,-12.9; 21 1.92,-12.9; 22 3.19,-12.9; 23 4.46,-12.9; 24 5.73,-12.9 | smd 6 x 6: P$1 0.34,-2.7

### Placement (x,y rotation side)
3VON  8,41.97 180 top
5VON  5.36,41.95 0 top
C1  15.6,11.41 270 top
C2  6.48,26.29 270 top
C3  9.27,29.46 180 top
C4  50.1,13.53 0 top
C5  48.45,33.97 270 top
C6  18.38,16.47 0 top
C7  46.23,33.91 270 top
C8  17.21,12.95 270 top
C9  18.73,12.95 90 top
C10  37.07,10.66 90 top
C11  9.4,31.37 180 top
C13  18.35,10.67 180 top
C14  15.86,35.84 270 top
C15  32.67,15.19 180 top
C16  11.89,38.33 0 top
C17  5.49,33.82 90 top
C18  10.29,35.81 90 top
C19  12.19,35.81 90 top
C20  14.1,35.81 90 top
CONN1  11.43,2.54 0 top
D2  44.2,10.73 270 top
DOWN  1.78,18.54 270 top
FID1  1.91,1.65 0 top
FID2  51.18,42.42 0 top
FID3  61.72,8.19 0 bottom
FID4  2.16,42.67 0 bottom
JP1  29.21,1.91 180 top
L  39.88,22.23 0 top
LED1  12.19,41.02 180 top
PC2  9.14,20.45 180 top
R1  43.31,16.64 90 top
R2  36.7,24.13 90 top
R3  39.88,25.15 90 top
R4  16.83,4.95 180 top
R5  35.52,6.08 180 top
R6  8,38.61 270 top
R7  5.33,38.61 90 top
R8  6.48,36.2 0 top
R9  44.58,13.78 180 top
R10  11.75,9.46 270 top
R15  13.69,33.25 180 top
RST  2.41,38.1 270 top
SENSE  48.9,4.51 180 top
SJ1  47.62,15.81 0 top
SJ2  48.83,10.92 180 top
TP1  58.42,4.45 0 top
TP2  58.42,40.13 0 top
U1  47.56,20.51 270 top
U2  9.27,26.29 0 top
U3  40.3,9.22 0 top
U4  11.05,14.61 180 top
U5  47.56,28.7 270 top
U$1  26.17,10.23 90 top
U$41  [MATRIXPORTAL_BOT]  63.5,0 0 bottom
U$44  [PCBFEAT-REV-040]  50.67,34.42 0 top
U$45  [MATRIXPORTAL_TOP]  0,0 0 top
UP  1.91,28.32 270 top
X1  57.15,22.23 270 top
X5  3.81,8.26 270 top
X6  26.31,31.7 0 top

### Tracks (layer width: path | path; a pad name or v marks a point on that pad's centre or on a via)
3.3V  (via drill 0.5)
  Top 0.203: C6.2 19.47,16.23 20.54,16.23 v20.65,16.33 22.29,14.68 U$1.48 22.42,14.35 | C16.2 12.89,38.48 12.89,41.86 12.93,41.9 LED1.2 12.72,43.12 9.21,43.12 8.09,43.12 3VON.A | 29.78,8.13 29.78,7.24 26.23,7.24 25.92,6.93 U$1.8 25.92,4.72 25.21,4 24.45,4 23.92,4.54 U$1.4 23.92,6.24 23.18,6.99 23.18,9.54 22.23,10.48 | 29.78,8.13 30.14,8.48 U$1.21 35.57,8.48 v35.95,8.86 35.81,8.99 35.81,10.35 36.97,11.51 C10.2 37.37,11.51 U3.8 | C15.2 31.38,15.62 29.42,15.62 U$1.34 29.36,14.62 29.36,8.95 29.78,8.52 29.78,8.13 | U4.14 U4.15 | U4.15 U4.16 | U4.15 U4.16 11.9,13.61 U4.1 | U4.8 U4.7 | 22.23,10.48 | v33.27,6.1 34.66,6.1 R5.2 | R1.1 44.39,14.71 46,14.71 46.48,14.22 v46.48,12.51
  Top 0.254: 22.42,14.35 22.42,11.81 | 22.42,11.81 22.42,10.67 22.23,10.48 | R8.2 9.02,36.2 | 22.42,11.81 22.49,11.88 v22.92,11.88 | R4.2 15.43,4.95 13.89,3.42 11.82,3.42 10.93,4.31 CONN1.2
  Top 0.305: C18.1 9.33,34.86 9.02,35.18 9.02,36.2 9.02,42.93 9.21,43.12 | C13.1 19.51,10.36 20.96,10.36 21.08,10.48 U$1.56 22.23,10.48 | U4.7 U4.15 | 10.93,8.13 11.24,8.13 11.7,8.59 11.7,10.33 11.27,10.76 R10.1 11.56,11.42 U4.16
  Top 0.406: U2.5 C3.2 | C3.2 8.32,29.91 8.26,29.97 8.26,29.53 C3.2 | C3.2 8.32,31.14 C11.2 8.55,32.64 | 8.55,32.64 8.55,33.12 C18.1 C19.1 C20.1 15.73,34.86 C14.2 16.3,35.43 X6.2 | 8.55,32.64 11.18,32.64 11.81,32 11.81,24.13 9.53,21.84 v9.53,17.11 9.53,16.98 U4.8 | v36.32,21.4 36.39,21.46 36.39,22.96 R2.1 | CONN1.2 10.93,8.13 R10.4 | v46.48,12.51 46.48,11.87 SJ2.3
  Bottom 0.203: v35.95,8.86 35.95,8.77 v33.27,6.1 34.29,6.1 36.7,3.68 37.78,3.68 39.37,2.1 JP1.2
  Bottom 0.406: v36.32,21.4 36.39,21.34 36.39,20.26 34.42,18.29 31.12,18.29 24.72,11.88 v22.92,11.88 | v20.65,16.33 15.99,16.33 15.68,16.64 9.99,16.64 v9.53,17.11 | v46.48,12.51 46.48,9.97 39.37,2.86 39.37,2.1
!RESET  (via drill 0.5)
  Top 0.203: RST.2 3.31,34.68 v2.79,34.16 | U$1.52 20.23,12.48 v19.88,12.84
  Top 0.254: RST.2 4.16,36 C17.2 5.49,36.05 R8.1
  Bottom 0.203: v2.79,34.16 2.54,33.91 2.54,16.07 4.7,13.91 4.7,8.89 6.48,7.11 10.34,7.11 | 10.34,7.11 15.75,12.52 19.56,12.52 v19.88,12.84 | 10.34,7.11 10.47,7.11 10.41,7.05 13.39,4.06 14.92,4.06 16.51,2.48 JP1.11
+5V  (via drill 0.5)
  Top 0.203: 47.62,23.59 U1.1 | U5.1 47.31,31.78 | 47.31,31.78 48.39,31.78 | 48.39,31.78 U5.20 | C2.2 5.9,25.34 5.08,26.16 5.08,29.34 6.48,30.73 6.48,36.96 5.68,37.76 R7.1 | 47.31,31.78 47.31,23.9 47.62,23.59 | 47.62,23.59 48.8,23.59 | 48.8,23.59 U1.20 | v48.77,23.56 48.8,23.59 | C7.2 48.29,32.96 C5.2 48.39,33.06 48.39,31.78
  Top 0.254: X5.B4A9 6.79,5.86 6.57,6.07 6.38,6.07 5.92,6.53 5.92,9.79 6.01,9.88 | 6.01,9.88 6.79,10.65 X5.A4B9 | 6.01,9.88 5.92,9.88
  Top 0.406: 8.21,25.1 7.97,25.34 C2.2 6.49,25.33 PC2.+ 6.49,15.51 4.7,13.72 4.7,11.1 5.92,9.88 | 8.21,25.1 U2.1 | U2.3 10.22,25.97 10.03,26.16 8.51,26.16 8.21,25.86 8.21,25.1 | SJ2.1 50.48,10.92 51.47,11.91 v51.47,12.1
  Top 0.61: X5.B4A9 8.18,5.86 8.44,5.6 v8.76,5.6 v8.76,5.59
  Bottom 0.305: v48.77,23.56 48.77,14.61 51.28,12.1 v51.47,12.1 50.83,11.46 50.83,8.48 54.86,4.45 TP1.P$1
  Bottom 0.61: TP1.P$1 46.61,4.45 42.72,0.56 14.55,0.56 9.53,5.59 v8.76,5.59
A0
  Top 0.203: U$1.3 23.42,4.39 25.34,2.48 25.34,1.62 26.26,0.7 42.61,0.7 43.05,1.14 43.05,10.48 44.2,11.62 D2.C 43.73,12.47 R9.2
A0_JST
  Top 0.203: R9.1 45.43,10.01 46.99,8.45 46.99,7.3 SENSE.3
A1  (via drill 0.5)
  Top 0.203: U$1.14 28.92,5.32 29.54,4.7 30.1,4.7 v30.48,4.32
  Bottom 0.203: v30.48,4.32 30.48,3.56 29.21,2.29 JP1.6
A2
  Top 0.203: U$1.13 28.42,5.22 29.45,4.19 29.47,4.19 JP1.5
A3
  Top 0.203: JP1.4 34.23,1.91 31,5.13 30.98,5.11 29.71,5.11 29.42,5.39 U$1.15
A4
  Top 0.203: U$1.16 31.11,5.78 33.59,3.3 35.43,3.3 JP1.3
ADDRA_3V  (via drill 0.5)
  Top 0.203: U$1.10 26.86,5.72 26.86,3.96 v27.77,3.05 | U1.4 44.09,21.64 42.48,23.24 v42.47,23.24
  Bottom 0.203: v42.47,23.24 41.99,22.76 41.99,20.14 35.26,13.41 34.8,13.41 26.69,5.3 26.69,4.13 v27.77,3.05
ADDRB_3V  (via drill 0.5)
  Top 0.203: U$1.11 27.42,4.58 27.71,4.29 v27.68,4.25 | U5.9 43.53,26.58 43.18,26.23 43.18,25.11 v43.5,24.8
  Bottom 0.203: v43.5,24.8 43.5,22.76 42.48,21.75 42.48,19.99 35.49,13.01 34.97,13.01 28.17,6.21 28.17,4.75 v27.68,4.25
ADDRC_3V  (via drill 0.5)
  Top 0.203: U$1.12 27.92,5.15 28.76,4.31 v28.76,3.7 | v43.24,20.45 43.37,20.32 43.39,20.34 U1.6
  Bottom 0.203: v43.24,20.45 43.24,20.13 35.71,12.6 35.13,12.6 28.62,6.09 28.62,3.84 v28.76,3.7
ADDRD_3V
  Top 0.203: U$1.28 30.68,11.92 33.53,11.92 42.32,20.72 42.32,20.73 42.99,21.4 43.69,21.4 44.1,20.98 U1.5
ADDRE_3V
  Top 0.203: U$1.26 33.74,10.98 41.79,19.04 U1.8
B1_3V  (via drill 0.5)
  Top 0.203: U$1.63 21.63,6.9 21.24,6.9 20.52,6.18 v19.84,6.18 | U5.4 44.45,30.02 42.26,30.02 41.54,30.74 v41.31,30.74
  Bottom 0.203: v41.31,30.74 41.09,30.74 39.93,29.57 39.93,21.25 35.39,16.71 31.47,16.71 20.94,6.18 v19.84,6.18 | v19.84,6.18
B2_3V  (via drill 0.5)
  Top 0.203: U5.7 44.52,28 42.68,28 v42.29,28.4 | U$1.6 24.92,4.79 v24.89,4.76
  Bottom 0.203: v42.29,28.4 41.17,27.28 41.17,20.54 34.86,14.22 34.35,14.22 v24.89,4.76
CC1
  Top 0.203: X5.A5 8.04,9.51 9.02,10.48 9.84,10.48 10.46,9.86 R10.2
CC2
  Top 0.203: X5.B5 8.15,6.5 10.03,8.39 10.03,8.7 10.39,9.06 R10.3
CLK  (via drill 0.5)
  Top 0.203: U5.12 49.02,26.58 v49.02,25.84
  Bottom 0.203: X1.13 X1.13S 52.96,15.88
  Bottom 0.305: v49.02,25.84 49.02,25.27 50.29,24 50.29,18.54 52.96,15.88
CLK_3V  (via drill 0.5)
  Top 0.203: v42.84,27.12 42.95,27.23 U5.8 | U$1.9 26.42,4.59 26.03,4.2 v26.03,3.69
  Bottom 0.203: v42.84,27.12 41.58,25.86 41.58,20.3 35.09,13.82 34.58,13.82 25.9,5.14 25.9,3.82 v26.03,3.69
D+  (via drill 0.5)
  Top 0.203: U$1.46 23.42,15.32 22.99,15.75 v22.99,15.81 | v9.08,8.51 9.08,8.57 8.26,8.57 8.26,8.51 | 8.26,8.51 X5.A6 | 8.26,8.51 8.26,7.62 8.14,7.5 X5.B6
  Bottom 0.203: v22.99,15.81 21.78,14.61 18.99,14.61 18.03,13.65 15.11,13.65 9.97,8.51 v9.08,8.51
D-  (via drill 0.5)
  Top 0.203: v9.4,9.71 8.96,9.71 8.25,9.01 X5.B7 7.34,9.02 6.48,9.02 6.35,8.89 6.35,8.13 6.47,8.01 X5.A7 | v21.93,16.15 22.38,16.6 23.15,16.6 | 23.15,16.6 23.41,16.6 23.92,16.08 U$1.45 | 23.15,16.6 | U$1.45
  Bottom 0.203: v9.4,9.71 10.54,9.71 14.89,14.06 17.69,14.06 18.7,15.07 21.04,15.07 22.02,16.06 v21.93,16.15
DOWN  (via drill 0.5)
  Top 0.203: DOWN.2 v4.76,16.44 v4.76,16.45 | U$1.50 21.19,13.48 20.89,13.78 20.89,14.35 20.13,15.11 16.57,15.11 14.35,17.34 13.02,17.34 11.3,19.05 v10.79,19.05
  Bottom 0.203: v4.76,16.45 7.3,18.99 10.73,18.99 v10.79,19.05
ESP_BUSY  (via drill 0.5)
  Top 0.203: U$1.43 24.92,16.35 23.52,17.74 17.55,17.74 v14.38,20.92 | v13.97,26.16 17.34,26.16 X6.9
  Bottom 0.203: v14.38,20.92 14.48,21.02 14.48,25.65 v13.97,26.16
ESP_CS
  Top 0.203: X6.29 36.06,25.27 36.35,24.98 R2.2 37.53,24.98 37.53,21.08 33.76,17.31 26.91,17.31 26.42,16.82 U$1.40
ESP_GPIO0
  Top 0.203: U$1.41 25.92,16.9 26.73,17.72 32.89,17.72 34.91,19.74 X6.25
ESP_RESET  (via drill 0.5)
  Top 0.203: U$1.42 25.42,17.17 25.36,17.11 v25.14,17.33 | v14.99,32 14.99,32.17 | R15.1 15,32.79 15,32.18
  Top 0.254: 14.99,32.17 15,32.18 16.98,34.16 X6.3
  Bottom 0.203: v14.99,32 15.24,31.75 15.24,19.05 16.64,17.65 24.81,17.65 v25.14,17.33
ESP_RTS
  Top 0.203: U$1.37 27.92,16.12 28.7,16.9 33.92,16.9 37.94,20.91 37.94,26.07 36.2,27.81 X6.31
ESP_RXD
  Top 0.203: X6.35 35.05,32.76 35.7,32.76 41.44,27.01 41.44,20.47 33.33,12.36 31.13,12.36 31,12.48 U$1.29
ESP_TXD
  Top 0.203: X6.34 36.2,31.62 41.03,26.78 41.03,20.64 33.19,12.79 31.32,12.79 31.13,12.98 U$1.30
FLASH_CS  (via drill 0.5)
  Top 0.203: U3.1 37.92,6.38 37.62,6.08 | 37.62,6.08 R5.1 | v34.48,9.84 34.34,9.98 U$1.24 | v37.4,4.95 37.4,5.87 37.62,6.08
  Bottom 0.203: v34.48,9.84 34.61,9.97 36.83,9.97 37.4,9.4 v37.4,4.95
FLASH_IO0
  Top 0.203: U$1.17 31.49,6.48 32.99,4.98 35.98,4.98 36.9,4.06 41.15,4.06 41.59,4.51 41.59,10.86 42.2,11.47 U3.5
FLASH_IO1
  Top 0.203: U$1.18 37.21,6.98 37.95,7.72 38.92,7.72 39.66,6.99 U3.2
FLASH_IO2
  Top 0.203: U$1.19 37.14,7.48 37.97,8.32 39.62,8.32 40.93,7.01 U3.3
FLASH_IO3
  Top 0.203: U$1.20 36.94,7.98 39.66,10.71 U3.7
FLASH_SCK
  Top 0.203: U3.6 40.93,13.93 40.32,14.54 38.54,14.54 35.31,11.31 35.31,9.4 34.89,8.98 33.98,8.98 33.48,9.48 U$1.23
G1_3V  (via drill 0.5)
  Top 0.203: U$1.62 20.52,7.48 20.3,7.26 v20.3,7.19 | U5.3 43,30.48 v42.36,31.12
  Bottom 0.203: v20.3,7.19 21.37,7.19 31.41,17.23 35.33,17.23 39.52,21.42 39.52,30.06 40.96,31.5 41.98,31.5 v42.36,31.12
G2_3V  (via drill 0.5)
  Top 0.203: U$1.5 24.42,7.04 v24.36,7.1 | U5.5 41.53,29.18 v41.35,29
  Bottom 0.203: v41.35,29 40.77,28.42 40.77,20.83 35.56,15.62 32.88,15.62 v24.36,7.1
GND  (via drill 0.5)
  Top 0.305: U$1.22 30.15,8.98 29.85,9.28 29.85,14.11 29.92,14.18 U$1.33 | U$1.7 25.42,8.46 26.17,9.21 U$1.EXP 27.69,10.23 v27.69,8.7 | C13.2 15.6,10.67 C1.2
  Top 0.406: X5.B1A12 7.71,5.05 9.02,3.75 9.78,3.75 9.93,3.9 CONN1.1
  other vias: 15.37,9.02 12.83,6.86 8.64,15.81 13.4,15.68 9.27,28.07 6.6,28.83 9.14,23.5 9.84,38.16 15.18,38.16 6.6,38.23 3.94,43.37 12.19,42.23 32.64,14.1 8.83,3.75 3.94,5.33 3.05,10.79 2.41,14.61 9.65,11.68 14.8,2.92 23.37,13.46 20.57,11.24 38.42,10.54 19.56,36.83 19.56,33.59 23.69,36.2 27.3,35.94 32.07,36.64 32.7,33.97 29.53,33.46 25.02,33.53 21.78,31.05 20.13,28.13 22.23,25.78 24.38,31.11 28.83,31.24 28.77,26.73 24.57,26.67 26.67,29.15 31.43,30.86 32.83,27.3 30.48,25.15 33.02,22.61 29.97,20.95 28.19,23.24 25.27,24.77 27.05,21.08 23.69,22.42 21.46,21.02 20.7,23.56 19.43,25.84 18.48,19.05 11.87,22.35 7.56,21.97 14.99,14.86 41.85,14.48 46.16,19.62 46.16,27.5 48.51,29.4 37.53,29.08 35.12,4.19
  pour Top: 0.06,0.06 63.5,0.06 63.5,44.26 49.09,44.32 49.09,37.91 15.68,37.91 15.68,44.26 0.06,44.26
  pour Bottom: 0.06,0.06 63.5,0.06 63.5,44.26 49.02,44.26 49.02,37.91 15.62,37.91 15.62,44.26 0.06,44.26
INT  (via drill 0.5)
  Top 0.203: U$1.51 20.99,12.98 20.45,13.53 20.45,14.16 19.9,14.71 16.41,14.71 14.19,16.93 12.16,16.93 v11.37,17.72 | v7.75,14.8 8.06,14.8 8.25,14.61 U4.11
  Bottom 0.203: v11.37,17.72 10.67,17.72 10.22,18.16 8.13,18.16 7.75,17.78 v7.75,14.8
LAT
  Top 0.203: U1.13 51.17,19.04 51.34,18.86 51.34,17.71 51.91,17.14 57.15,17.14 X1.14
  Bottom 0.203: X1.14S X1.14
LAT_3V
  Top 0.203: U$1.27 33.66,11.48 41.87,19.69 U1.7
M1_A
  Top 0.305: U1.16 55.85,20.98 X1.9
  Bottom 0.203: X1.9S X1.9
M1_B
  Top 0.203: U5.11 50.48,25.53 53.78,22.23 57.15,22.23 X1.10
  Bottom 0.203: X1.10S X1.10
M1_B1
  Top 0.203: U5.16 51.59,29.18 52.2,28.57 X1.3
  Bottom 0.203: X1.3S X1.3
M1_B2
  Top 0.203: X1.7 55.81,23.5 55.75,23.43 54.23,24.96 53.72,24.96 51.45,27.23 U5.13
  Bottom 0.203: X1.7S X1.7
M1_C
  Top 0.203: U1.14 51.12,19.69 52.39,18.41 X1.11
  Bottom 0.203: X1.11S X1.11
M1_D
  Top 0.203: U1.15 51.1,20.34 51.75,19.68 57.15,19.68 X1.12
  Bottom 0.203: X1.12S X1.12
M1_E
  Top 0.203: SJ1.2 47.62,17.14 48.87,18.39 U1.12
M1_E8  (via drill 0.5)
  Top 0.203: SJ1.1 46.74,16.32 46.74,16.83 47.43,17.53 47.43,22.23 v47.5,22.23
  Bottom 0.203: v47.5,22.23 47.12,22.61 47.12,26.92 47.88,27.69 48.96,27.69 51.82,24.83 57.09,24.83 X1.8 X1.8S
M1_E16
  Top 0.203: SJ1.3 50.16,14.67 56.64,14.67 57.98,13.34 X1.16
  Bottom 0.203: X1.16S X1.16
M1_G1
  Top 0.203: U5.17 57.13,29.83 X1.2
  Bottom 0.203: X1.2S 58.55,31.11 58.48,31.05
  Bottom 0.305: 58.48,31.05 X1.2
M1_G2
  Top 0.203: U5.15 51.48,28.53 52.64,27.37 56.71,27.37 58.04,26.04 X1.6
  Bottom 0.203: X1.6S X1.6
M1_R1
  Top 0.203: U5.18 51.05,30.48 51.69,31.11 X1.1
  Bottom 0.203: X1.1S 55.75,31.11
  Bottom 0.305: X1.1 55.82,31.05 55.75,31.11
M1_R2
  Top 0.203: U5.14 51.43,27.88 53.28,26.04 X1.5
  Bottom 0.203: 55.82,25.97 X1.5 | X1.5S 55.75,26.04
  Bottom 0.305: 55.75,26.04 55.82,25.97
MISO  (via drill 0.5)
  Top 0.203: U$1.36 28.42,15.96 28.96,16.5 34.09,16.5 38.34,20.75 38.34,26.24 36.58,28.01 36.58,28.64 v36.45,28.77 | v37.47,34.8 36.83,35.43 X6.37
  Bottom 0.203: v37.47,34.8 36.51,33.85 36.51,28.7 v36.45,28.77
MOSI  (via drill 0.5)
  Top 0.203: U$1.38 27.42,16.51 v27.24,16.51 | v16.13,21.46 X6.13
  Bottom 0.203: v27.24,16.51 27.3,16.58 27.3,17.21 26.36,18.16 16.76,18.16 16.13,18.8 v16.13,21.46
N$1
  Top 0.305: 5VON.A 5.36,39.46 R7.2
N$2
  Top 0.203: 3VON.C R6.1
N$3
  Top 0.203: 49.15,10.86 49.91,10.86
N$4
  Top 0.203: U$1.31 31.21,13.48 31.36,13.34 33.16,13.34 39.88,20.06 L.A
N$5
  Top 0.203: R3.1 L.C
NEOPIX  (via drill 0.5)
  Top 0.203: U$1.44 24.42,16.16 23.24,17.34 17.08,17.34 14.73,19.68 v14.29,19.68 | v14.03,38.54 14.03,40.05 LED1.1
  Bottom 0.203: v14.29,19.68 14.1,19.68 13.08,20.7 13.08,37.59 v14.03,38.54
OE  (via drill 0.5)
  Top 0.203: U1.11 50.42,17.68 v50.42,15.94
  Bottom 0.203: v50.42,15.94 50.42,15.24 52.32,13.34 X1.15S 55.63,13.34 X1.15
OE_3V
  Top 0.203: U$1.25 33.86,10.48 41.76,18.39 43.18,18.39 | U1.9 43.18,18.39 | R1.2 43.31,18.26 43.18,18.39
R1_3V  (via drill 0.5)
  Top 0.203: v19.16,7.07 19.16,7.32 19.82,7.98 U$1.61 | v39.69,31.5 40.26,32.07 42.55,32.07 43.5,31.11 44.63,31.11 U5.2
  Bottom 0.203: v19.16,7.07 19.16,7.19 19.92,7.96 21.51,7.96 31.21,17.65 35.18,17.65 39.12,21.59 39.12,30.73 39.69,31.3 v39.69,31.5
R2_3V  (via drill 0.5)
  Top 0.203: U$1.64 21.59,6.48 20.89,5.78 20.89,5.58 20.64,5.33 v20.64,5.2 | v46.23,29.75 46.04,29.57 46.04,28.53 U5.6
  Bottom 0.203: v20.64,5.2 31.5,16.06 35.38,16.06 40.34,21.02 40.34,29.41 40.68,29.75 v46.23,29.75
RXI  (via drill 0.5)
  Top 0.203: U$1.2 22.92,5.02 v22.66,4.76
  Bottom 0.203: v22.66,4.76 23.75,4.76 26.61,1.91 JP1.7
SCK  (via drill 0.5)
  Top 0.203: U$1.35 28.92,15.83 29.15,16.05 34.28,16.05 38.79,20.55 38.79,26.81 37.79,27.81 v37.79,27.94 | X6.30 35.16,26.29 v36.58,26.29
  Bottom 0.203: v37.79,27.94 37.79,27.5 v36.58,26.29
SCL
  Top 0.203: U4.4 12.78,15.11 12.95,14.93 12.95,10.76 R10.8 13.62,10.76 14.03,10.35 14.03,6.54 12.93,5.44 CONN1.4
  Top 0.254: U$1.59 19.2,8.98 16.73,6.51 14.14,6.51 12.93,5.31 CONN1.4
SDA  (via drill 0.5)
  Top 0.203: 12.41,3.87 11.93,4.36 CONN1.3 11.93,7.49 R10.5 | U4.6 12.06,16.46 13.76,16.46 14.23,16 14.23,14.54 14.48,14.29 14.48,7.81 v14.8,7.49
  Top 0.254: U$1.60 19.43,8.48 16.85,5.91 14.88,5.91 v14.62,5.65 13.8,4.83 13.8,4 13.67,3.87 12.41,3.87
  Bottom 0.203: v14.8,7.49 14.8,5.82 v14.62,5.65
SWCLK  (via drill 0.5)
  Top 0.203: U$1.57 21.34,9.98 21.21,9.86 17.24,9.86 v16.51,9.13
  Top 0.254: JP1.10 19.05,3.58 R4.1
  Bottom 0.203: JP1.10 19.05,3.66 16.45,6.26 16.45,9.07 v16.51,9.13
SWDIO  (via drill 0.5)
  Top 0.203: U$1.58 21.66,9.42 18.37,9.42 v17.59,8.64
  Bottom 0.203: v17.59,8.64 17.61,8.64 17.61,5.88 JP1.9
TXO
  Top 0.203: U$1.1 21.65,5.02 21.65,3.81 23.56,1.91 JP1.8
UP  (via drill 0.5)
  Top 0.203: UP.2 4.2,24.83 v4.32,24.83 | v13.4,18.1 13.72,17.78 14.61,17.78 16.83,15.56 20.57,15.56 21.72,14.41 U$1.49
  Bottom 0.203: v4.32,24.83 6.16,24.83 12.95,18.03 13.34,18.03 v13.4,18.1
VCC
  Top 0.406: SENSE.2 48.9,10.99 SJ2.2 48.83,13.21 C4.1
VDDCORE
  Top 0.203: U$1.53 21.66,12.05 18.79,12.05 C9.1 C8.2 15.86,12.1 C1.1

### Text on the board
tPlace: 5V | 3V
tNames: 1
214bmp: D:/SmartProjects/Snc/a4_bn_logo2.bmp